# Altium project CCS_v3.PrjPcb
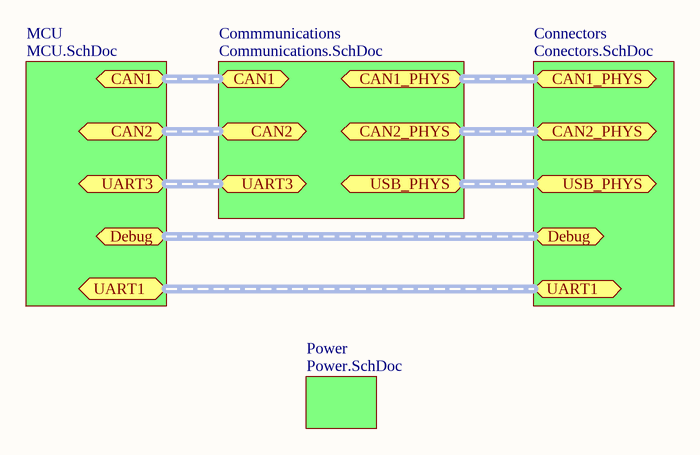
[diagram p0: Main.SchDoc]
5 sheets, 37 parts. Net scope: flat (ports and power ports of the same name join across sheets).
Board files: CCS_V3.1.PcbDoc, CCS_V3.2.PcbDoc, CCS_v3.3.PcbDoc
Sheets:
  Main.SchDoc
    MCU = MCU.SchDoc
    Connectors = Conectors.SchDoc
    Commmunications = Communications.SchDoc
    Power = Power.SchDoc

## Sheet Main.SchDoc
size A4

### Sub-sheets
Commmunications = Communications.SchDoc: no entries
Connectors = Conectors.SchDoc: no entries
MCU = MCU.SchDoc: no entries
Power = Power.SchDoc: no entries

### Ports
CAN1 (harness CAN), CAN1_PHYS (harness CAN_PHYS), CAN2 (harness CAN), CAN2_PHYS (harness CAN_PHYS), Debug (harness Debug), UART1 (harness UART), UART3 (harness UART with Flow Control), USB_PHYS (harness USB_PHYS)

## Sheet MCU.SchDoc
size A4
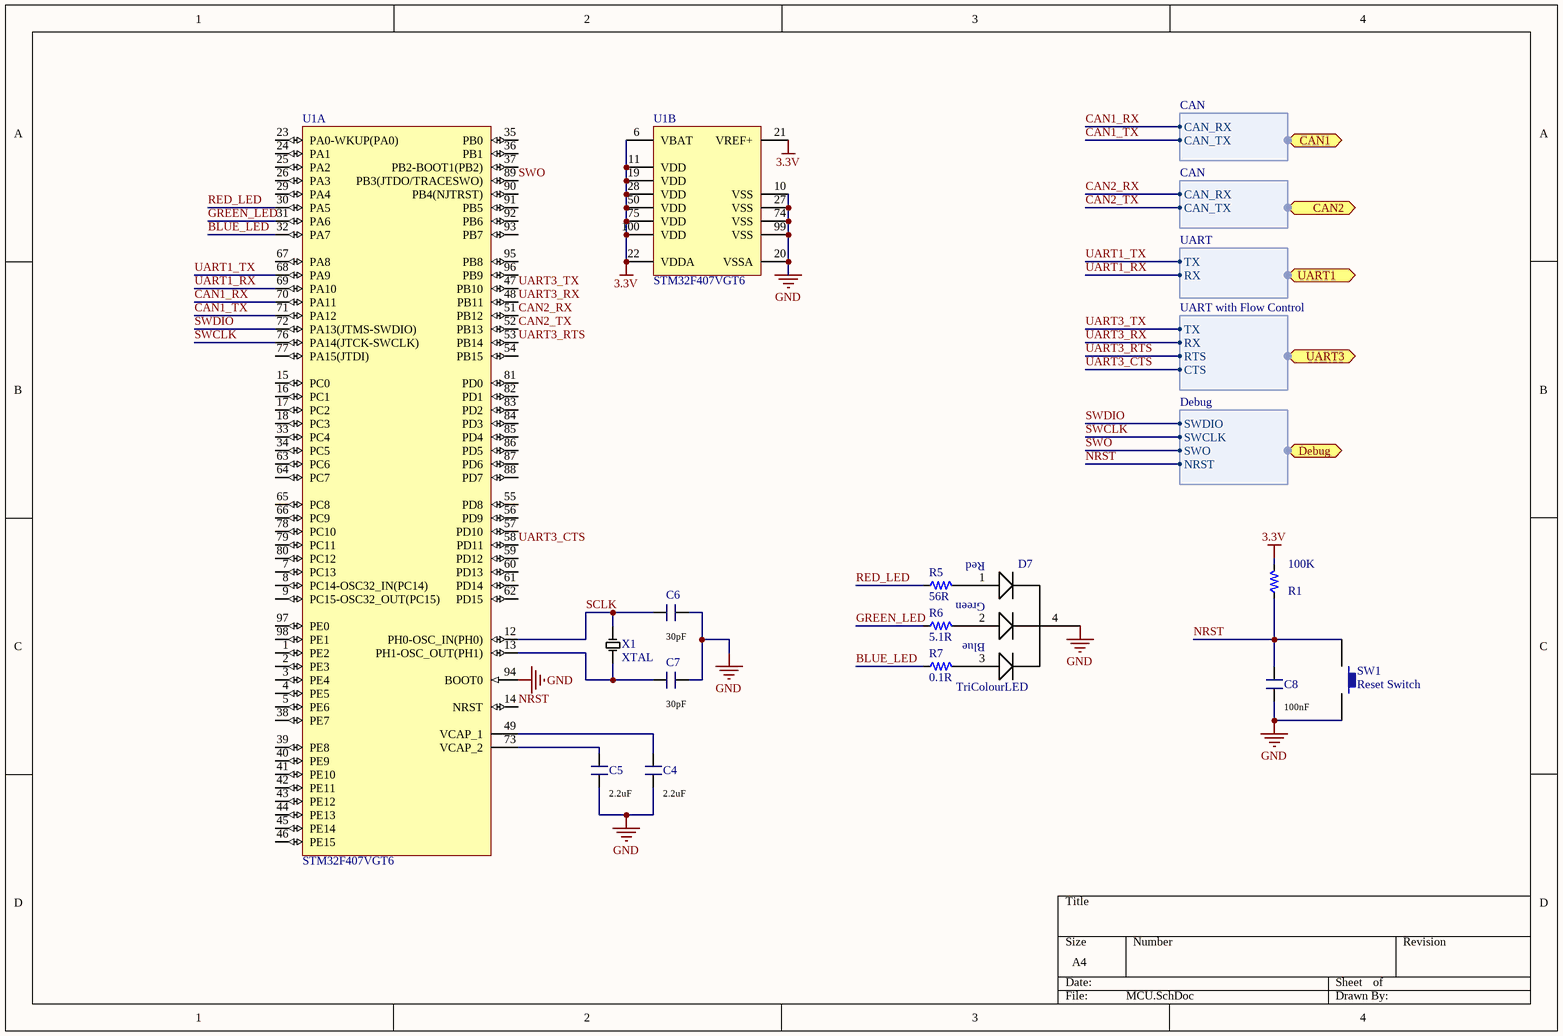
[diagram p1: MCU.SchDoc]

### Parts
C4  Capacitance: 2.2uF  [PCB_GENERIC_SMD_0603]  (hidden comment: SCH_GENERIC_CAPACITOR_0603)
C5  Capacitance: 2.2uF  [PCB_GENERIC_SMD_0603]  (hidden comment: SCH_GENERIC_CAPACITOR_0603)
C6  Capacitance: 30pF  [PCB_GENERIC_SMD_0603]  (hidden comment: SCH_GENERIC_CAPACITOR_0603)
C7  Capacitance: 30pF  [PCB_GENERIC_SMD_0603]  (hidden comment: SCH_GENERIC_CAPACITOR_0603)
C8  Capacitance: 100nF  [PCB_GENERIC_SMD_0603]  (hidden comment: SCH_GENERIC_CAPACITOR_0603)
D7  TriColourLED  [TricolourLED - SunLED - DK  1497-1225-2-ND]
R1  Resistance: 100K  [PCB_GENERIC_SMD_0603]  (hidden comment: SCH_GENERIC_RESISTOR_0603)
R5  Resistance: 56R  [PCB_GENERIC_SMD_0603]  (hidden comment: SCH_GENERIC_RESISTOR_0603)
R6  Resistance: 5.1R  [PCB_GENERIC_SMD_0603]  (hidden comment: SCH_GENERIC_RESISTOR_0603)
R7  Resistance: 0.1R  [PCB_GENERIC_SMD_0603]  (hidden comment: SCH_GENERIC_RESISTOR_0603)
SW1  Reset Switch  [Push Button Switch]
U1  STM32F407VGT6  [STM-LQFP100_M]  (parts A,B of 2)
X1  XTAL  [CRYSTAL_8MHZ]

### Ports
CAN1 (harness CAN), CAN2 (harness CAN), Debug (harness Debug), UART1 (harness UART), UART3 (harness UART with Flow Control)

### Harnesses
CAN: CAN_RX, CAN_TX
Debug: SWDIO, SWCLK, SWO, NRST
UART with Flow Control: TX, RX, RTS, CTS
UART: TX, RX

### Nets
3.3V: R1.2 U1.6(VBAT) U1.11(VDD) U1.19(VDD) U1.21(VREF+) U1.22(VDDA) U1.28(VDD) U1.50(VDD) U1.75(VDD) U1.100(VDD)
GND: C4.1 C5.1 C6.1 C7.1 C8.2 D7.4 SW1.2 U1.10(VSS) U1.20(VSSA) U1.27(VSS) U1.74(VSS) U1.94(BOOT0) U1.99(VSS)
BLUE_LED: R7.1 U1.32(PA7)
CAN1_RX: U1.70(PA11) ; port CAN1.CAN_RX
CAN1_TX: U1.71(PA12) ; port CAN1.CAN_TX
CAN2_RX: U1.51(PB12) ; port CAN2.CAN_RX
CAN2_TX: U1.52(PB13) ; port CAN2.CAN_TX
GREEN_LED: R6.1 U1.31(PA6)
NRST: C8.1 R1.1 SW1.1 U1.14(NRST) ; port Debug.NRST
RED_LED: R5.1 U1.30(PA5)
SCLK: C6.2 U1.12(PH0-OSC_IN(PH0)) X1.1
SWCLK: U1.76(PA14(JTCK-SWCLK)) ; port Debug.SWCLK
SWDIO: U1.72(PA13(JTMS-SWDIO)) ; port Debug.SWDIO
SWO: U1.89(PB3(JTDO/TRACESWO)) ; port Debug.SWO
UART1_RX: U1.69(PA10) ; port UART1.RX
UART1_TX: U1.68(PA9) ; port UART1.TX
UART3_CTS: U1.58(PD11) ; port UART3.CTS
UART3_RTS: U1.53(PB14) ; port UART3.RTS
UART3_RX: U1.48(PB11) ; port UART3.RX
UART3_TX: U1.47(PB10) ; port UART3.TX
NetC4_2: C4.2 U1.49(VCAP_1)
NetC5_2: C5.2 U1.73(VCAP_2)
NetC7_2: C7.2 U1.13(PH1-OSC_OUT(PH1)) X1.2
NetD7_1: D7.1(Red) R5.2
NetD7_2: D7.2(Green) R6.2
NetD7_3: D7.3(Blue) R7.2

Not connected (* = marked no-connect by the designer): U1 1(PE2) 2(PE3) 3(PE4) 4(PE5) 5(PE6) 7(PC13) 8(PC14-OSC32_IN(PC14)) 9(PC15-OSC32_OUT(PC15)) 15(PC0) 16(PC1) 17(PC2) 18(PC3) 23(PA0-WKUP(PA0)) 24(PA1) 25(PA2) 26(PA3) 29(PA4) 33(PC4) 34(PC5) 35(PB0) 36(PB1) 37(PB2-BOOT1(PB2)) 38(PE7) 39(PE8) 40(PE9) 41(PE10) 42(PE11) 43(PE12) 44(PE13) 45(PE14) 46(PE15) 54(PB15) 55(PD8) 56(PD9) 57(PD10) 59(PD12) 60(PD13) 61(PD14) 62(PD15) 63(PC6) 64(PC7) 65(PC8) 66(PC9) 67(PA8) 77(PA15(JTDI)) 78(PC10) 79(PC11) 80(PC12) 81(PD0) 82(PD1) 83(PD2) 84(PD3) 85(PD4) 86(PD5) 87(PD6) 88(PD7) 90(PB4(NJTRST)) 91(PB5) 92(PB6) 93(PB7) 95(PB8) 96(PB9) 97(PE0) 98(PE1)

### Library data of the parts
C4-C8 = SCH_GENERIC_CAPACITOR_0603: Generic SMD capacitor 0603; Tolerance: *%
R1 R5-R7 = SCH_GENERIC_RESISTOR_0603: Generic SMD resistor 0603
SW1 = PushButtonSwitch
U1 = STM32F407VGT6: ARM Cortex-M4 32-bit MCU+FPU, 210 DMIPS, 1024 kB Flash, 192 kB Internal RAM, 82 I/Os, 100-pin LQFP, -40 to 85 degC, Tray; Manufacturer: STMicroelectronics; D/A Converter: 2x12-bit; FLASH Size (Prog) (kB): 1024; I/Os (High Current): 82; Internal RAM Size (kB): 192; Operating Frequency(F) (Processor speed) (MHz): 168; Supply Voltage(Vcc) max (V): 3.6; Supply Voltage(Vcc) min (V): 1.8; DatasheetVersion: Rev. 4; PackageVersion: Rev. 1, 06/2013; PackageReference: LQFP100; PackageDescription: 100-Pin Low Profile Quad Flat Package, 14 x 14 mm Body, 0.5 mm Pitch; Supplier 1: Digi-Key; Supplier Part Number 1: 497-11605-ND; Supplier 2: Farnell; Supplier Part Number 2: 2064368; Supplier 3: Newark; Supplier Part Number 3: 73T2333; Supplier 4: Mouser; Supplier Part Number 4: 511-STM32F407VGT6; Core: ARM Cortex-M4; Packing: Tray; Mounting Technology: Surface Mount; PartNumber: STM32F407VGT6; ComponentLink1Description: Manufacturer URL; ComponentLink1URL: http://www.st.com/web/en/home.html; ComponentLink2Description: Datasheet; ComponentLink2URL: http://www.st.com/st-web-ui/static/active/en/resource/technical/document/datasheet/DM00037051.pdf; ComponentLink3Description: Package Specification; ComponentLink3URL: http://www.st.com/st-web-ui/static/active/en/resource/technical/document/data_brief/DM00071938.pdf
X1 = Crystal: Frequency: 8MHz

## Sheet Conectors.SchDoc
size A4
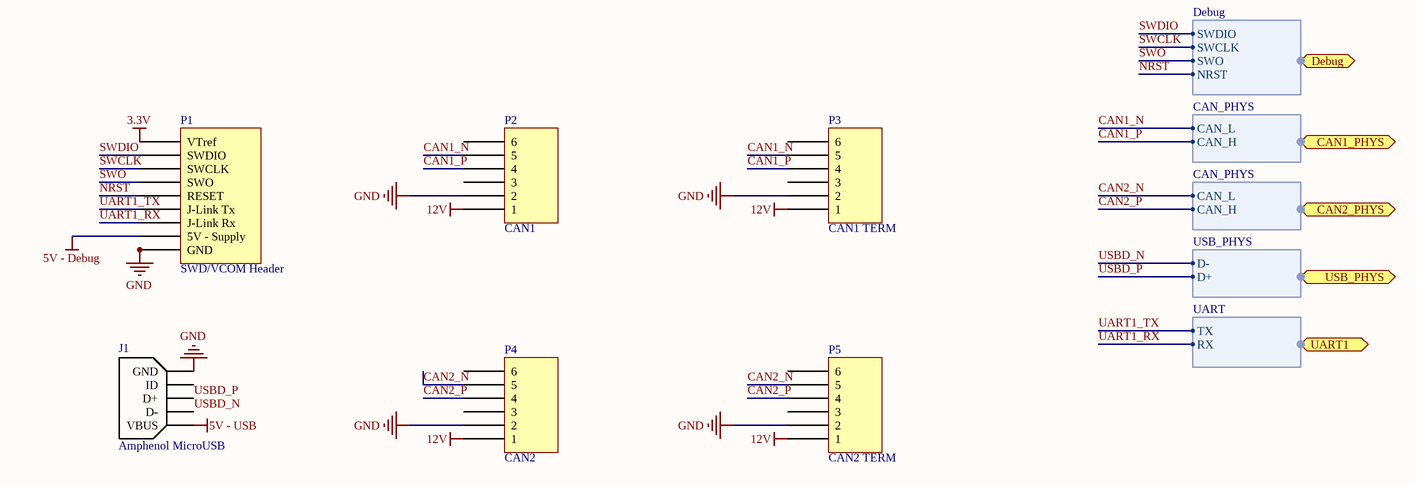
[diagram p2: Conectors.SchDoc]

### Parts
J1  Amphenol MicroUSB  [Amphenol MicroUSB]
P1  SWD/VCOM Header  [Samtec TST-110-01-G-D]
P2  CAN1  [PCB_MLX_MICROFIT_3X2]
P3  CAN1 TERM  [PCB_MLX_MICROFIT_3X2]
P4  CAN2  [PCB_MLX_MICROFIT_3X2]
P5  CAN2 TERM  [PCB_MLX_MICROFIT_3X2]

### Ports
CAN1_PHYS (harness CAN_PHYS), CAN2_PHYS (harness CAN_PHYS), Debug (harness Debug), UART1 (harness UART), USB_PHYS (harness USB_PHYS)

### Harnesses
Debug: SWDIO, SWCLK, SWO, NRST
CAN_PHYS: CAN_L, CAN_H
USB_PHYS: D-, D+
UART: TX, RX

### Nets
3.3V: P1.1(VTref)
5V - Debug: P1.19(5V_-_Supply)
5V - USB: J1.1(VBUS)
12V: P2.1 P3.1 P4.1 P5.1
GND: J1.5(GND) P1.4(GND) P1.6(GND) P1.8(GND) P1.10(GND) P1.12(GND) P2.2 P3.2 P4.2 P5.2
CAN1_N: P2.5 P3.5 ; port CAN1_PHYS.CAN_L
CAN1_P: P2.4 P3.4 ; port CAN1_PHYS.CAN_H
CAN2_N: P4.5 P5.5 ; port CAN2_PHYS.CAN_L
CAN2_P: P4.4 P5.4 ; port CAN2_PHYS.CAN_H
NRST: P1.15(RESET) ; port Debug.NRST
SWCLK: P1.9(SWCLK) ; port Debug.SWCLK
SWDIO: P1.7(SWDIO) ; port Debug.SWDIO
SWO: P1.13(SWO) ; port Debug.SWO
UART1_RX: P1.17(J-Link_Rx) ; port UART1.RX
UART1_TX: P1.5(J-Link_Tx) ; port UART1.TX
USBD_N: J1.2(D-) ; port USB_PHYS.D-
USBD_P: J1.3(D+) ; port USB_PHYS.D+

Not connected (* = marked no-connect by the designer): J1 4(ID); P2 3 6; P3 3 6; P4 3 6; P5 3 6

### Library data of the parts
J1 = Amphenol MicroUSB - 609-4618-1-ND
P2-P5 = SCH_MLX_MICROFIT_3X2

## Sheet Communications.SchDoc
size A4
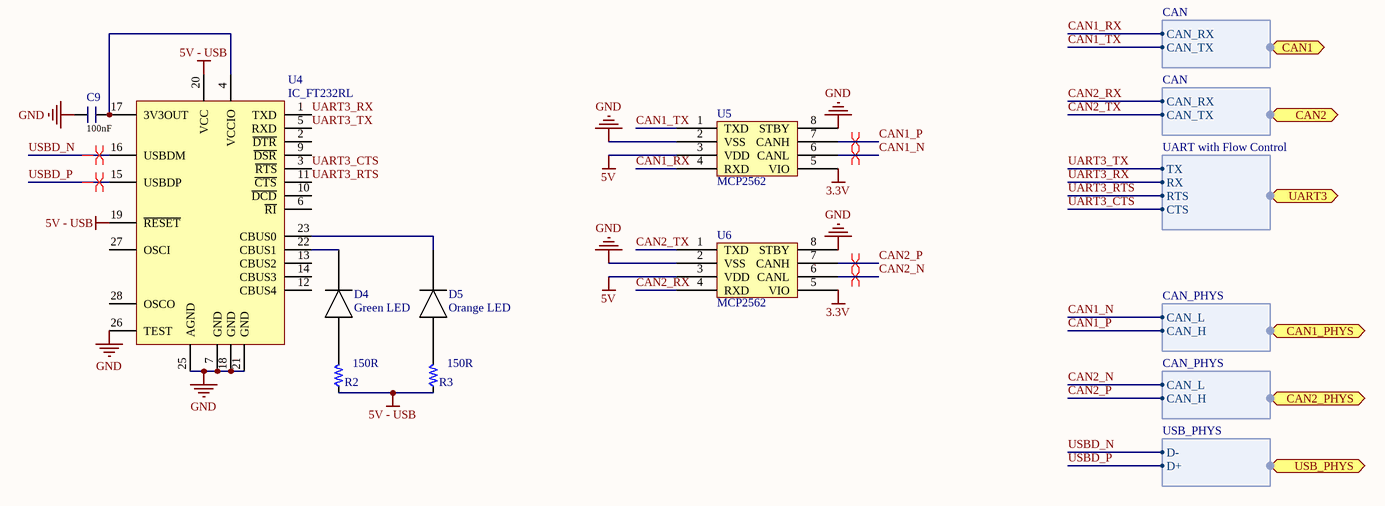
[diagram p3: Communications.SchDoc]

### Parts
C9  Capacitance: 100nF  [PCB_GENERIC_SMD_0603]  (hidden comment: SCH_GENERIC_CAPACITOR_0603)
D4  Green LED  [SMD_0603_LED]
D5  Orange LED  [SMD_0603_LED]
R2  Resistance: 150R  [PCB_GENERIC_SMD_0603]  (hidden comment: SCH_GENERIC_RESISTOR_0603)
R3  Resistance: 150R  [PCB_GENERIC_SMD_0603]  (hidden comment: SCH_GENERIC_RESISTOR_0603)
U4  IC_FT232RL  [SSOP-28]
U5  MCP2562  [MCP2562]
U6  MCP2562  [MCP2562]

### Ports
CAN1 (harness CAN), CAN1_PHYS (harness CAN_PHYS), CAN2 (harness CAN), CAN2_PHYS (harness CAN_PHYS), UART3 (harness UART with Flow Control), USB_PHYS (harness USB_PHYS)

### Harnesses
CAN_PHYS: CAN_L, CAN_H
CAN: CAN_RX, CAN_TX
UART with Flow Control: TX, RX, RTS, CTS
USB_PHYS: D-, D+

### Nets
3.3V: U5.5(VIO) U6.5(VIO)
5V: U5.3(VDD) U6.3(VDD)
5V - USB: R2.1 R3.1 U4.19(~{RESET}) U4.20(VCC)
GND: C9.2 U4.7(GND) U4.18(GND) U4.21(GND) U4.25(AGND) U4.26(TEST) U5.2(VSS) U5.8(STBY) U6.2(VSS) U6.8(STBY)
NC: U4.8(NC) U4.24(NC)
CAN1_N: U5.6(CANL) ; port CAN1_PHYS.CAN_L
CAN1_P: U5.7(CANH) ; port CAN1_PHYS.CAN_H
CAN1_RX: U5.4(RXD) ; port CAN1.CAN_RX
CAN1_TX: U5.1(TXD) ; port CAN1.CAN_TX
CAN2_N: U6.6(CANL) ; port CAN2_PHYS.CAN_L
CAN2_P: U6.7(CANH) ; port CAN2_PHYS.CAN_H
CAN2_RX: U6.4(RXD) ; port CAN2.CAN_RX
CAN2_TX: U6.1(TXD) ; port CAN2.CAN_TX
UART3_CTS: U4.3(~{RTS}) ; port UART3.CTS
UART3_RTS: U4.11(~{CTS}) ; port UART3.RTS
UART3_RX: U4.1(TXD) ; port UART3.RX
UART3_TX: U4.5(RXD) ; port UART3.TX
USBD_N: U4.16(USBDM) ; port USB_PHYS.D-
USBD_P: U4.15(USBDP) ; port USB_PHYS.D+
NetC9_1: C9.1 U4.4(VCCIO) U4.17(3V3OUT)
NetD4_1: D4.1 R2.2
NetD4_2: D4.2 U4.22(CBUS1)
NetD5_1: D5.1 R3.2
NetD5_2: D5.2 U4.23(CBUS0)

Not connected (* = marked no-connect by the designer): U4 2(~{DTR}) 6(~{RI}) 9(~{DSR}) 10(~{DCD}) 12(CBUS4) 13(CBUS2) 14(CBUS3) 27(OSCI) 28(OSCO)

### Layout directives
differential pair: CAN1_N, CAN1_P, CAN2_N, CAN2_P, USBD_N, USBD_P

### Library data of the parts
C9 = SCH_GENERIC_CAPACITOR_0603: as C4 on sheet MCU
D4 D5 = SMD_0603_LED
R2 R3 = SCH_GENERIC_RESISTOR_0603: Generic SMD resistor 0603
U4 = IC_FT232RL: FT232R USB UART; Manufacturer: *; Note: *; ManufacturerPartNo: *

## Sheet Power.SchDoc
size A4
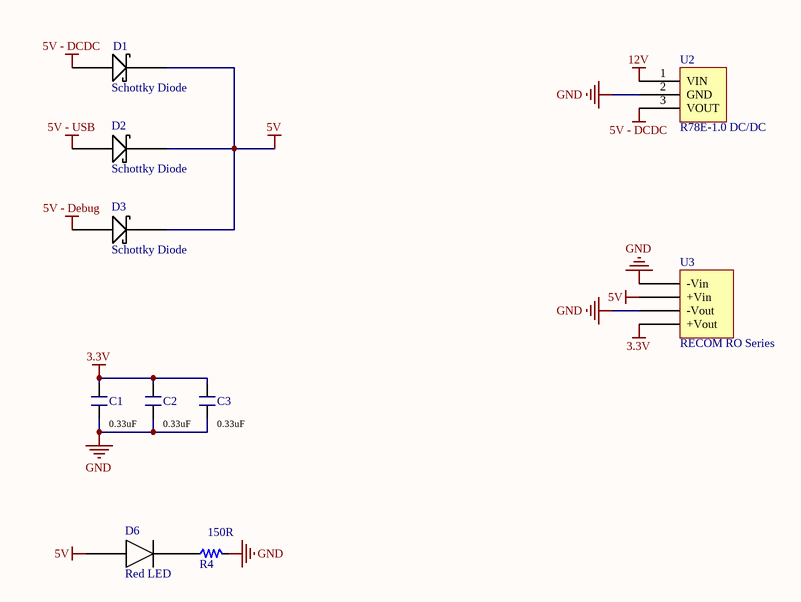
[diagram p4: Power.SchDoc]

### Parts
C1  Capacitance: 0.33uF  [PCB_GENERIC_SMD_0603]  (hidden comment: SCH_GENERIC_CAPACITOR_0603)
C2  Capacitance: 0.33uF  [PCB_GENERIC_SMD_0603]  (hidden comment: SCH_GENERIC_CAPACITOR_0603)
C3  Capacitance: 0.33uF  [PCB_GENERIC_SMD_0603]  (hidden comment: SCH_GENERIC_CAPACITOR_0603)
D1  Schottky Diode  [ON Semi Schottky Diode - MBRM110LT1G]
D2  Schottky Diode  [ON Semi Schottky Diode - MBRM110LT1G]
D3  Schottky Diode  [ON Semi Schottky Diode - MBRM110LT1G]
D6  Red LED  [SMD_0603_LED]
R4  Resistance: 150R  [PCB_GENERIC_SMD_0603]  (hidden comment: SCH_GENERIC_RESISTOR_0603)
U2  R78E-1.0 DC/DC  [R78-1.0]
U3  RECOM RO Series  [RECOM RO Series 1W DCDC]

### Nets
3.3V: C1.2 C2.2 C3.2 U3.4(+Vout)
5V: D1.1 D2.1 D3.1 D6.1 U3.2(+Vin)
5V - DCDC: D1.2 U2.3(VOUT)
5V - Debug: D3.2
5V - USB: D2.2
12V: U2.1(VIN)
GND: C1.1 C2.1 C3.1 R4.2 U2.2(GND) U3.1(-Vin) U3.3(-Vout)
NetD6_2: D6.2 R4.1

### Library data of the parts
C1 = SCH_GENERIC_CAPACITOR_0603: Generic SMD capacitor 0603
C2 C3 = SCH_GENERIC_CAPACITOR_0603: as C4 on sheet MCU
D1-D3 = ON Semi Schottky Diode - MBRM110LT1G
D6 = SMD_0603_LED
R4 = SCH_GENERIC_RESISTOR_0603: Generic SMD resistor 0603
U2 = R78E-1.0
U3 = RECOM RO Series DCDC Converter

## Nets that join several sheets
3.3V: MCU (10 pins), Conectors (P1.1), Communications (U5.5 U6.5), Power (C1.2 C2.2 C3.2 U3.4)
5V: Communications (U5.3 U6.3), Power (5 pins)
5V - Debug: Conectors (P1.19), Power (D3.2)
5V - USB: Conectors (J1.1), Communications (R2.1 R3.1 U4.19 U4.20), Power (D2.2)
12V: Conectors (P2.1 P3.1 P4.1 P5.1), Power (U2.1)
GND: MCU (13 pins), Conectors (10 pins), Communications (10 pins), Power (7 pins)
CAN1_N: Conectors (P2.5 P3.5), Communications (U5.6)
CAN1_P: Conectors (P2.4 P3.4), Communications (U5.7)
CAN1_RX: MCU (U1.70), Communications (U5.4)
CAN1_TX: MCU (U1.71), Communications (U5.1)
CAN2_N: Conectors (P4.5 P5.5), Communications (U6.6)
CAN2_P: Conectors (P4.4 P5.4), Communications (U6.7)
CAN2_RX: MCU (U1.51), Communications (U6.4)
CAN2_TX: MCU (U1.52), Communications (U6.1)
NRST: MCU (C8.1 R1.1 SW1.1 U1.14), Conectors (P1.15)
SWCLK: MCU (U1.76), Conectors (P1.9)
SWDIO: MCU (U1.72), Conectors (P1.7)
SWO: MCU (U1.89), Conectors (P1.13)
UART1_RX: MCU (U1.69), Conectors (P1.17)
UART1_TX: MCU (U1.68), Conectors (P1.5)
UART3_CTS: MCU (U1.58), Communications (U4.3)
UART3_RTS: MCU (U1.53), Communications (U4.11)
UART3_RX: MCU (U1.48), Communications (U4.1)
UART3_TX: MCU (U1.47), Communications (U4.5)
USBD_N: Conectors (J1.2), Communications (U4.16)
USBD_P: Conectors (J1.3), Communications (U4.15)